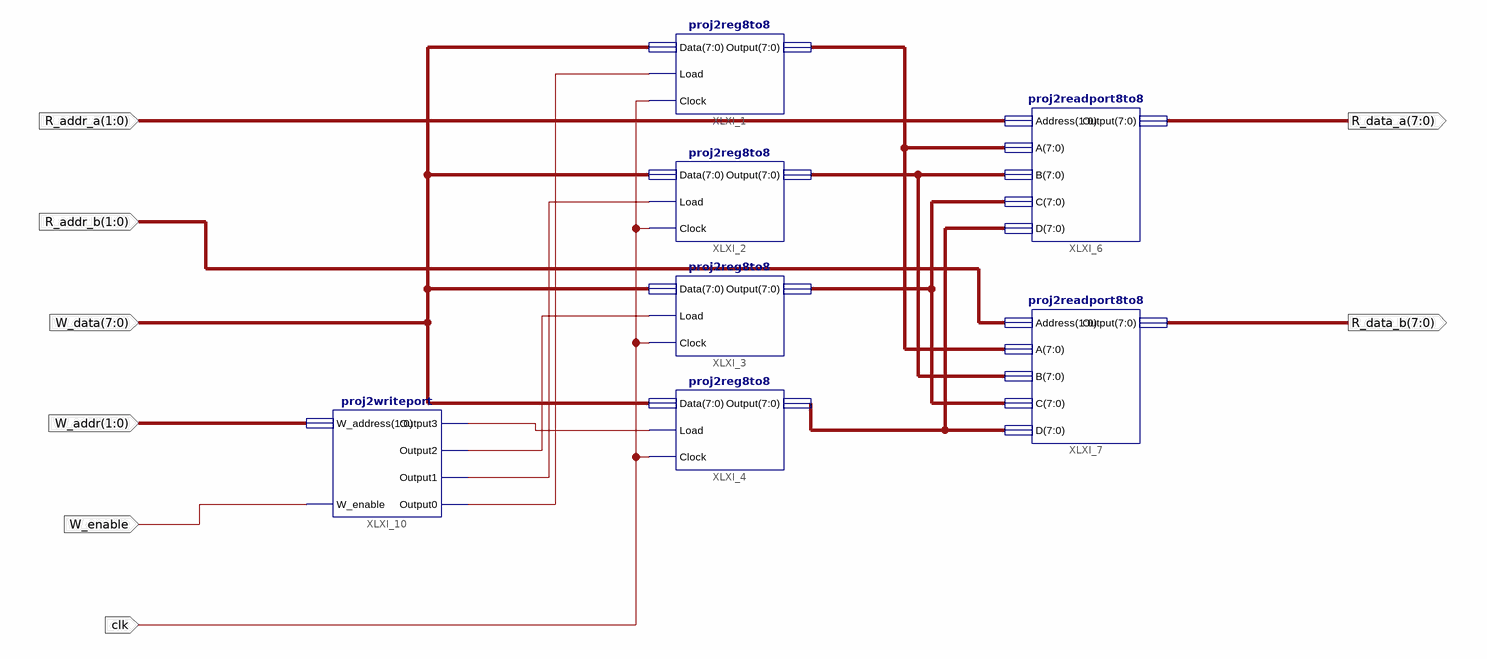
[diagram p0: schematic sheet 1]
// Xilinx ISE schematic RegFile.sch (spartan6) as structural Verilog: 7 symbols, 8 ports
module RegFile (
  input  [1:0] R_addr_a,
  input  [1:0] R_addr_b,
  input  [7:0] W_data,
  input  [1:0] W_addr,
  input  clk,
  input  W_enable,
  output [7:0] R_data_a,
  output [7:0] R_data_b
);

  wire XLXN_18, XLXN_19, XLXN_20, XLXN_21;
  wire [7:0] XLXN_4, XLXN_5, XLXN_8, XLXN_9;

  proj2reg8to8 XLXI_1 (.Data(W_data), .Load(XLXN_18), .Clock(clk), .Output(XLXN_4));
  proj2reg8to8 XLXI_2 (.Data(W_data), .Load(XLXN_19), .Clock(clk), .Output(XLXN_5));
  proj2reg8to8 XLXI_3 (.Data(W_data), .Load(XLXN_20), .Clock(clk), .Output(XLXN_8));
  proj2reg8to8 XLXI_4 (.Data(W_data), .Load(XLXN_21), .Clock(clk), .Output(XLXN_9));
  proj2readport8to8 XLXI_6 (.Address(R_addr_a), .A(XLXN_4), .B(XLXN_5), .C(XLXN_8), .D(XLXN_9), .Output(R_data_a));
  proj2readport8to8 XLXI_7 (.Address(R_addr_b), .A(XLXN_4), .B(XLXN_5), .C(XLXN_8), .D(XLXN_9), .Output(R_data_b));
  proj2writeport XLXI_10 (
    .W_address(W_addr), .W_enable(W_enable), .Output3(XLXN_21), .Output2(XLXN_20), .Output1(XLXN_19),
    .Output0(XLXN_18));
endmodule
